# EAGLE design UltrasonicSensor (EAGLE 7.2.0)
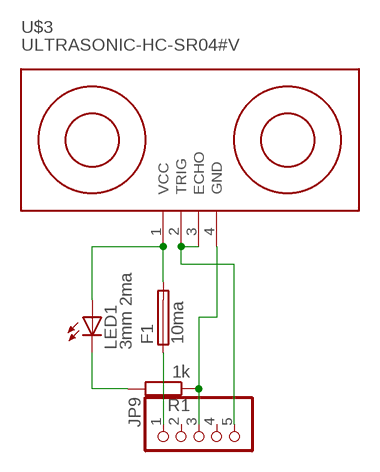
[diagram p0: schematic, sheet 1]

## Parts
F1  10ma  MF-SMDF050  [MF-SMDF050]
JP9  PINHD-1X5  [1X05]
LED1  3mm 2ma  TLLY4400  [LED3MM]
R1  1k  R-EU_M1206  [M1206]
U$3  ULTRASONIC-HC-SR04#V  [ULTRASONIC-HC-SR04#V]

## Nets
N$1: JP9.3 R1.1 U$3.4(GND)
N$2: F1.1 JP9.1
N$3: F1.2 LED1.A U$3.1(VCC)
N$4: LED1.K(C) R1.2
N$9: JP9.5 U$3.2(TRIG) U$3.3(ECHO)
Unconnected: JP9.2 JP9.4

## Library data of the parts
F1 = fuse:MF-SMDF: MF-SMDF Series - PRC Resettable Fuses Source: http://www.farnell.com/datasheets/716597.pdf
JP9 = pinhead:PINHD-1X5: PIN HEADER
LED1 = led:TLLY4400: Low Current (2mA) LED 3 mm Tinted Diffused Package color YELLOW Source: Data sheet <http://www.farnell.com/datasheets/391098.pdf>; MF: VISHAY SEMICONDUCTOR; OC_FARNELL: 1612439
R1 = rcl:R-EU_: RESISTOR, European symbol
U$3 = diy-modules:ULTRASONIC-HC-SR04: Ultrasonic Ranging Module HC-SR04 More details available here: http://randomnerdtutorials.com/complete-guide-for-ultrasonic-sensor-hc-sr04/ Click here to find device on ebay.com <http://www.ebay.com/sch/hc+sr04+ultrasonic>

## Board
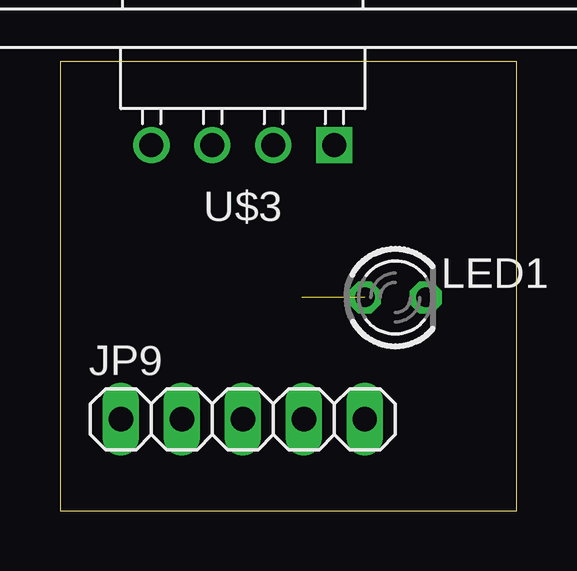
[diagram p1: board, top side]
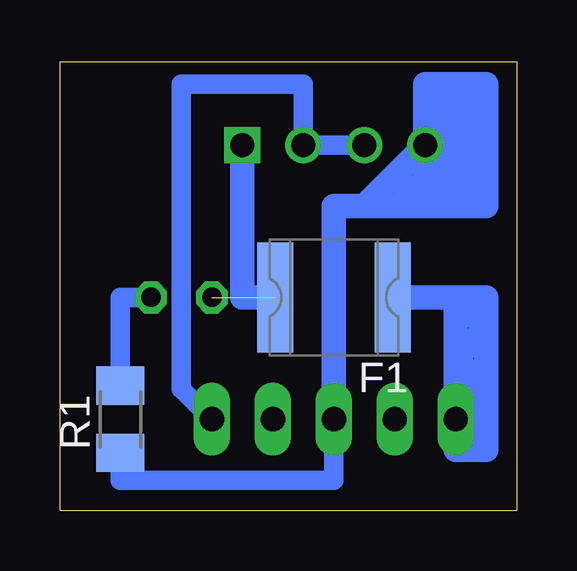
[diagram p2: board, bottom side, seen from below]

Size 19.03 x 18.72 mm. Coordinates in mm from the lower left corner, seen from the top.
Outline: 0,0 19.03,0 19.03,18.72 0,18.72 0,0
Copper layers (1*16): Top 0.035mm / dielectric 1.5mm / Bottom 0.035mm
Design rules "default": minimum track width 10mil, minimum drill 24mil, track to track 8mil, track to pad 8mil, pad to pad 8mil, via to via 8mil, smd to smd 8mil, copper to edge 40mil, drill to drill 8mil, minimum pad ring 10mil, minimum via ring 8mil, stop-mask expansion 4mil, vias tented up to drill 0mil, thermal gap 10mil

### Footprints (pad centres in the part's own frame; a part is rotated, then mirrored left to right if it is on the bottom)
MF-SMDF050 = smd 1.5 x 4.6: 1 -2.45,0; 2 2.45,0
1X05 = drill 1.016 long: 1 -5.08,0; 2 -2.54,0; 3 0,0; 4 2.54,0; 5 5.08,0
LED3MM = drill 0.813 octagon: A -1.27,0; K 1.27,0
M1206 = smd 1.6 x 2: 1 -1.4,0; 2 1.4,0
ULTRASONIC-HC-SR04#V = drill 1 square: 1 -3.81,0 | drill 1: 2 -1.27,0; 3 1.27,0; 4 3.81,0

### Placement (x,y rotation side)
F1  7.62,8.89 180 bottom
JP9  7.62,3.81 0 top
LED1  13.97,8.89 0 top
R1  16.51,3.81 90 bottom
U$3  7.62,15.24 180 top

### Tracks (layer width: path | path; a pad name or v marks a point on that pad's centre or on a via)
N$1
  Bottom 0.813: R1.1 16.51,1.27 7.62,1.27 JP9.3
  Bottom 1.016: JP9.3 7.62,12.7 6.35,12.7 | 6.35,12.7 U$3.4 | 6.35,12.7 1.27,12.7 1.27,17.78 3.81,17.78 U$3.4 | 3.81,13.97 U$3.4
N$2
  Bottom 1.016: 2.54,8.89 F1.1 | 2.54,8.89 1.27,8.89 1.27,7.62 | 1.27,7.62 1.27,5.08 | 1.27,5.08 1.27,3.81 | 1.27,3.81 JP9.1 | JP9.1 2.54,6.35 | 2.54,6.35 1.27,7.62 | 1.27,7.62 2.54,8.89 | 2.54,8.89 2.54,6.35 | 2.54,6.35 1.27,5.08 | 1.27,5.08 JP9.1 | 2.54,2.54 1.27,3.81 | 1.27,3.81 1.27,2.54 2.54,2.54 | 2.54,2.54 JP9.1
N$3  (1 unrouted)
  Bottom 1.016: F1.2 11.43,8.89 U$3.1
N$4
  Bottom 0.813: R1.2 16.51,8.89 LED1.K
N$9
  Bottom 0.813: U$3.3 U$3.2 8.89,17.78 13.97,17.78 13.97,5.08 JP9.5
(copper drawn outside any net)
  shapes: Bottom area x2